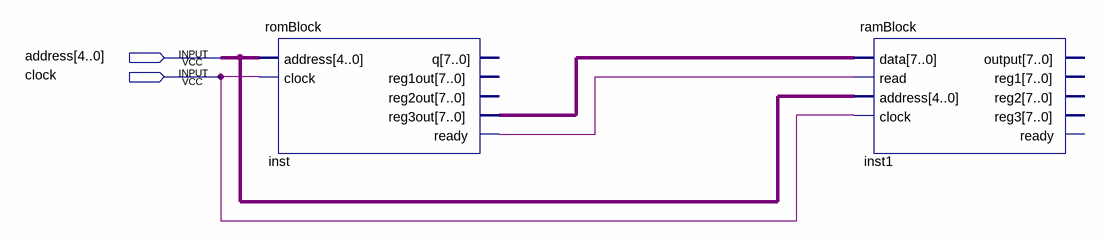
[diagram p0: schematic sheet]
// Quartus schematic sifoLab3.bdf as structural Verilog: 2 symbols, 2 pins
module sifoLab3 (
  input  [4:0] address,
  input  clock
);

  wire inst_ready;
  wire [7:0] inst_reg3out;

  romBlock inst (
    .address(address), .clock(clock), .reg3out(inst_reg3out), .ready(inst_ready));  // open: q, reg1out, reg2out
  ramBlock inst1 (
    .data(inst_reg3out), .read(inst_ready), .address(address), .clock(clock));  // open: output, reg1, reg2, reg3, ready
endmodule
